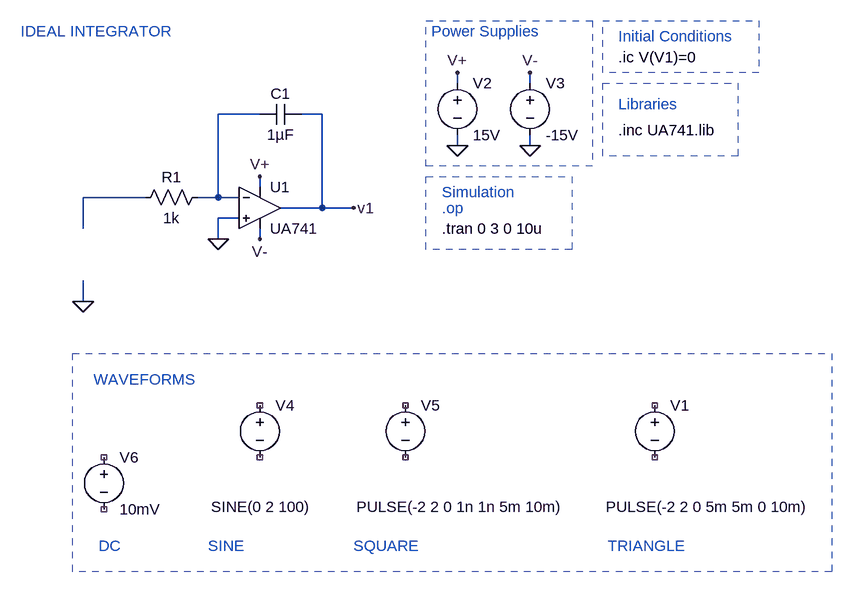
[diagram p0: schematic Ideal_Integrator.asc]
Ideal_Integrator.asc, the LTspice schematic file:
Version 4.1
SHEET 1 1348 740
WIRE 752 -128 752 -144
WIRE 864 -128 864 -144
WIRE 448 -80 384 -80
WIRE 544 -80 512 -80
WIRE 752 -32 752 -48
WIRE 864 -32 864 -48
WIRE 448 32 448 16
WIRE 272 48 176 48
WIRE 384 48 384 -80
WIRE 384 48 352 48
WIRE 416 48 384 48
WIRE 544 64 544 -80
WIRE 544 64 480 64
WIRE 592 64 544 64
WIRE 416 80 384 80
WIRE 176 96 176 48
WIRE 384 112 384 80
WIRE 448 112 448 96
WIRE 176 208 176 176
FLAG 752 -32 0
FLAG 864 -32 0
FLAG 752 -144 V+
FLAG 864 -144 V-
FLAG 448 16 V+
FLAG 448 112 V-
FLAG 592 64 v1
FLAG 384 112 0
FLAG 176 208 0
SYMBOL OpAmps\\opamp2 448 0 R0
SYMATTR InstName U1
SYMATTR Value UA741
SYMBOL voltage 752 -144 R0
WINDOW 123 0 0 Left 0
WINDOW 39 0 0 Left 0
SYMATTR InstName V2
SYMATTR Value 15V
SYMBOL voltage 864 -144 R0
WINDOW 123 0 0 Left 0
WINDOW 39 0 0 Left 0
SYMATTR InstName V3
SYMATTR Value -15V
SYMBOL res 368 32 R90
WINDOW 0 0 56 VBottom 2
WINDOW 3 32 56 VTop 2
SYMATTR InstName R1
SYMATTR Value 1k
SYMBOL cap 512 -96 R90
WINDOW 0 0 32 VBottom 2
WINDOW 3 32 32 VTop 2
SYMATTR InstName C1
SYMATTR Value 1µF
SYMBOL voltage 448 352 R0
WINDOW 3 -75 172 Left 2
WINDOW 123 0 0 Left 0
WINDOW 39 0 0 Left 0
SYMATTR Value SINE(0 2 100)
SYMATTR InstName V4
SYMBOL voltage 672 352 R0
WINDOW 3 -75 172 Left 2
WINDOW 123 0 0 Left 0
WINDOW 39 0 0 Left 0
SYMATTR Value PULSE(-2 2 0 1n 1n 5m 10m)
SYMATTR InstName V5
SYMBOL voltage 208 432 R0
SYMATTR InstName V6
SYMATTR Value 10mV
SYMBOL voltage 1056 352 R0
WINDOW 3 -75 172 Left 2
WINDOW 123 0 0 Left 0
WINDOW 39 0 0 Left 0
SYMATTR Value PULSE(-2 2 0 5m 5m 0 10m)
SYMATTR InstName V1
TEXT 712 -208 Left 2 ;Power Supplies
TEXT 1000 -56 Left 2 !.inc UA741.lib
TEXT 728 64 Left 2 ;.op
TEXT 728 40 Left 2 ;Simulation
TEXT 1000 -96 Left 2 ;Libraries
TEXT 728 96 Left 2 !.tran 0 3 0 10u
TEXT 1000 -168 Left 2 !.ic V(V1)=0
TEXT 1000 -200 Left 2 ;Initial Conditions
TEXT 80 -208 Left 2 ;IDEAL INTEGRATOR
TEXT 192 328 Left 2 ;WAVEFORMS
TEXT 200 584 Left 2 ;DC
TEXT 368 584 Left 2 ;SINE
TEXT 592 584 Left 2 ;SQUARE
TEXT 984 584 Left 2 ;TRIANGLE
RECTANGLE Normal 960 0 704 -224 1
RECTANGLE Normal 928 128 704 16 1
RECTANGLE Normal 1184 -16 976 -128 1
RECTANGLE Normal 1216 -144 976 -224 1
RECTANGLE Normal 1328 624 160 288 1

The netlist it stands for:
* Ideal_Integrator.asc
X§U1 0 N001 V+ V- v1 UA741  ; pins In+ In- V+ V- OUT
V2 V+ 0 15V
V3 V- 0 -15V
R1 N001 N002 1k
C1 v1 N001 1µF
V4 NC_01 NC_02 SINE(0 2 100)
V5 NC_03 NC_04 PULSE(-2 2 0 1n 1n 5m 10m)
V6 NC_05 NC_06 10mV
V1 NC_07 NC_08 PULSE(-2 2 0 5m 5m 0 10m)
* Power Supplies
.inc UA741.lib
* .op
* Simulation
* Libraries
.tran 0 3 0 10u
.ic V(V1)=0
* Initial Conditions
* IDEAL INTEGRATOR
* WAVEFORMS
* DC
* SINE
* SQUARE
* TRIANGLE
.backanno
.end